# EAGLE design Nova_Placa (EAGLE 9.7.0)
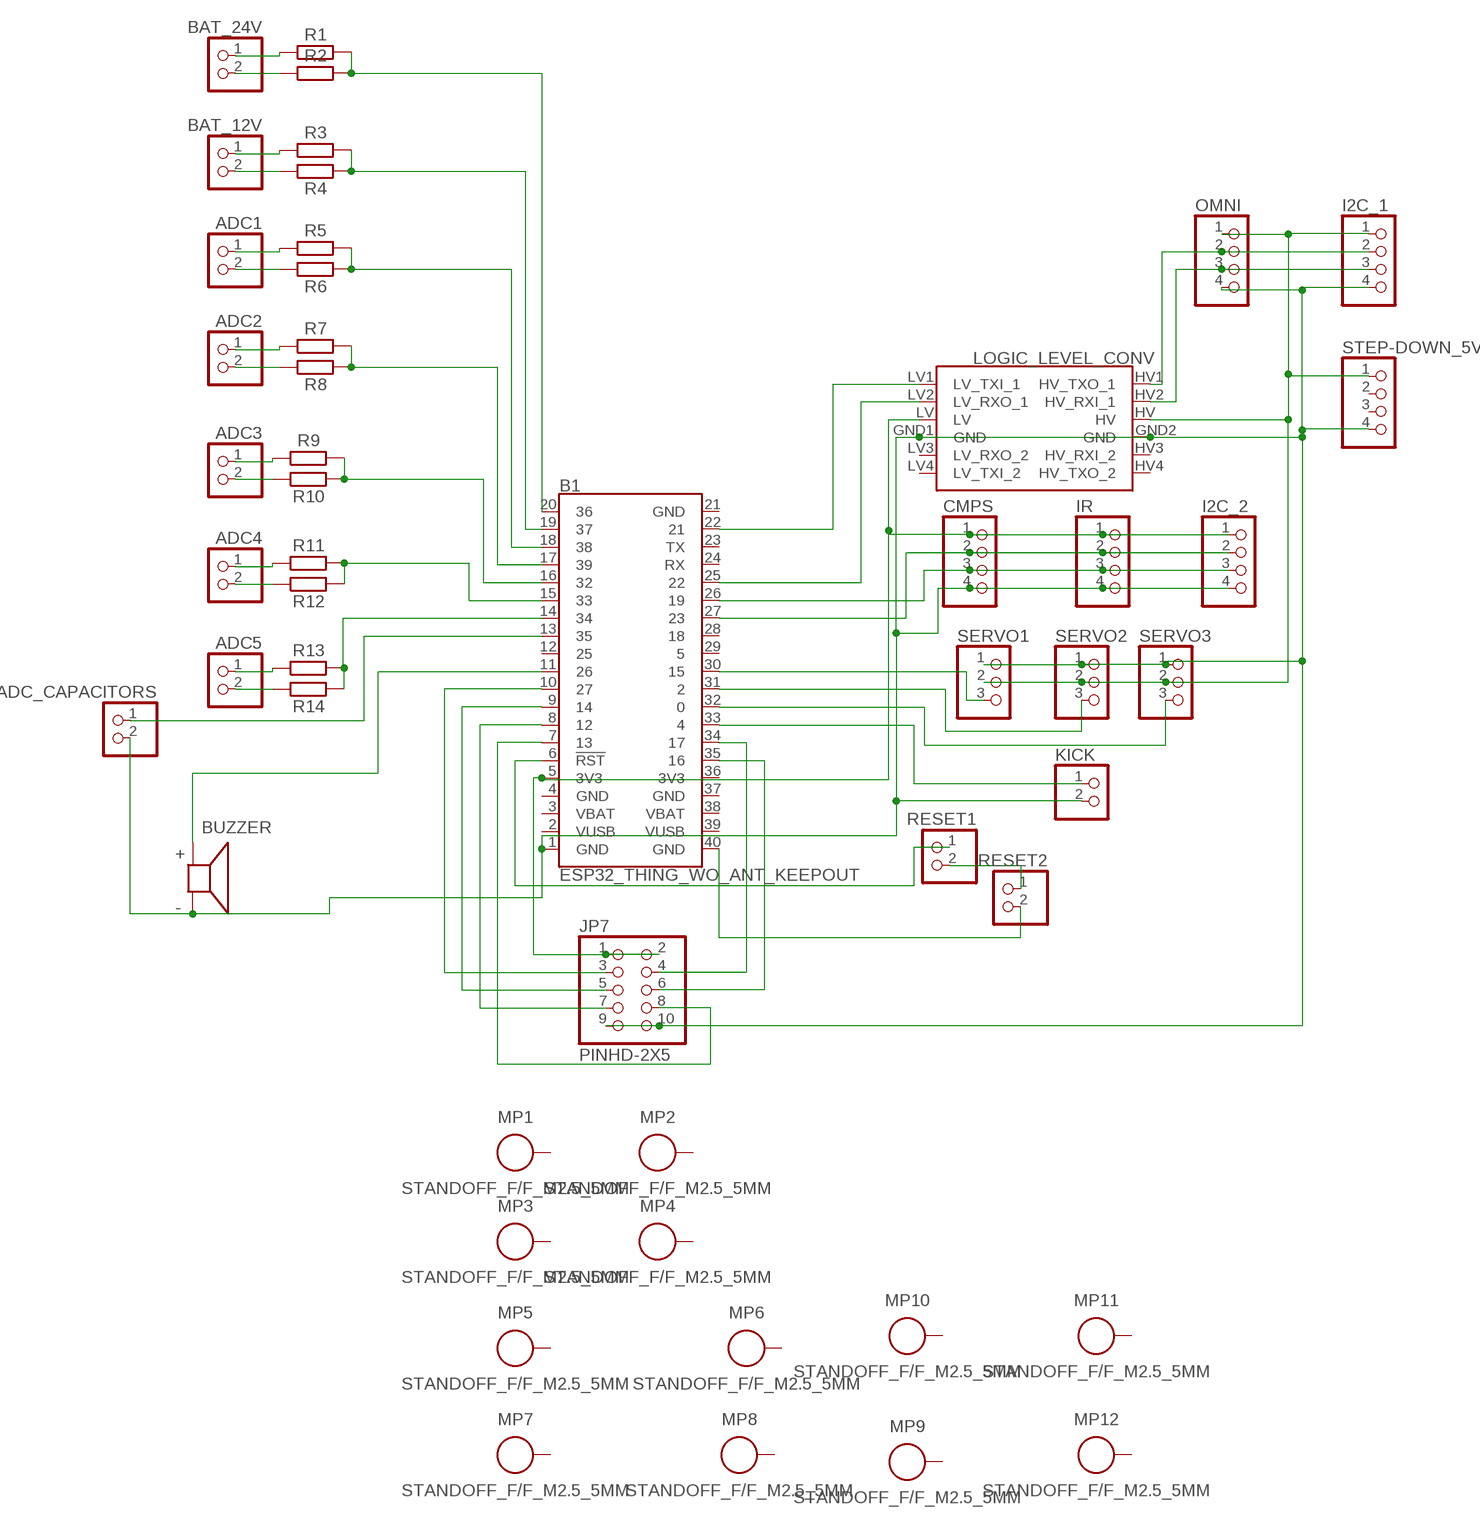
[diagram p0: schematic, sheet 1]

## Parts
ADC1  PINHD-1X2  [1X02]
ADC2  PINHD-1X2  [1X02]
ADC3  PINHD-1X2  [1X02]
ADC4  PINHD-1X2  [1X02]
ADC5  PINHD-1X2  [1X02]
ADC_CAPACITORS  PINHD-1X2  [1X02]
B1  ESP32_THING_WO_ANT_KEEPOUT  [ESP32_THING_NO_ANT]
BAT_12V  PINHD-1X2  [1X02]
BAT_24V  PINHD-1X2  [1X02]
BUZZER  AT-1220-TT-9-R  [XDCR_AT-1220-TT-9-R]
CMPS  PINHD-1X4  [1X04]
I2C_1  PINHD-1X4  [1X04]
I2C_2  PINHD-1X4  [1X04]
IR  PINHD-1X4  [1X04]
JP7  PINHD-2X5  [2X05]
KICK  PINHD-1X2  [1X02]
LOGIC_LEVEL_CONV  SPARKFUN_LOGIC_LEVEL_CONVERTERLOCK  [SPARKFUN_LOGIC_LEVEL_CONVERTER_LOCK]
MP1  STANDOFF_F/F_M2.5_5MM  [STANDOFF_HEX_FEMALE_500X500_M2.5X0.45_MTGP755H270]
MP2  STANDOFF_F/F_M2.5_5MM  [STANDOFF_HEX_FEMALE_500X500_M2.5X0.45_MTGP755H270]
MP3  STANDOFF_F/F_M2.5_5MM  [STANDOFF_HEX_FEMALE_500X500_M2.5X0.45_MTGP755H270]
MP4  STANDOFF_F/F_M2.5_5MM  [STANDOFF_HEX_FEMALE_500X500_M2.5X0.45_MTGP755H270]
MP5  STANDOFF_F/F_M2.5_5MM  [STANDOFF_HEX_FEMALE_500X500_M2.5X0.45_MTGP755H270]
MP6  STANDOFF_F/F_M2.5_5MM  [STANDOFF_HEX_FEMALE_500X500_M2.5X0.45_MTGP755H270]
MP7  STANDOFF_F/F_M2.5_5MM  [STANDOFF_HEX_FEMALE_500X500_M2.5X0.45_MTGP755H270]
MP8  STANDOFF_F/F_M2.5_5MM  [STANDOFF_HEX_FEMALE_500X500_M2.5X0.45_MTGP755H270]
MP9  STANDOFF_F/F_M2.5_5MM  [STANDOFF_HEX_FEMALE_500X500_M2.5X0.45_MTGP755H270]
MP10  STANDOFF_F/F_M2.5_5MM  [STANDOFF_HEX_FEMALE_500X500_M2.5X0.45_MTGP755H270]
MP11  STANDOFF_F/F_M2.5_5MM  [STANDOFF_HEX_FEMALE_500X500_M2.5X0.45_MTGP755H270]
MP12  STANDOFF_F/F_M2.5_5MM  [STANDOFF_HEX_FEMALE_500X500_M2.5X0.45_MTGP755H270]
OMNI  PINHD-1X4  [1X04]
R1  R_AXIAL-7.2MM-PITCH  [RESAD724W46L381D178B]
R2  R_AXIAL-7.2MM-PITCH  [RESAD724W46L381D178B]
R3  R_AXIAL-7.2MM-PITCH  [RESAD724W46L381D178B]
R4  R_AXIAL-7.2MM-PITCH  [RESAD724W46L381D178B]
R5  R_AXIAL-7.2MM-PITCH  [RESAD724W46L381D178B]
R6  R_AXIAL-7.2MM-PITCH  [RESAD724W46L381D178B]
R7  R_AXIAL-7.2MM-PITCH  [RESAD724W46L381D178B]
R8  R_AXIAL-7.2MM-PITCH  [RESAD724W46L381D178B]
R9  R_AXIAL-7.2MM-PITCH  [RESAD724W46L381D178B]
R10  R_AXIAL-7.2MM-PITCH  [RESAD724W46L381D178B]
R11  R_AXIAL-7.2MM-PITCH  [RESAD724W46L381D178B]
R12  R_AXIAL-7.2MM-PITCH  [RESAD724W46L381D178B]
R13  R_AXIAL-7.2MM-PITCH  [RESAD724W46L381D178B]
R14  R_AXIAL-7.2MM-PITCH  [RESAD724W46L381D178B]
RESET1  PINHD-1X2  [1X02]
RESET2  PINHD-1X2  [1X02]
SERVO1  PINHD-1X3  [1X03]
SERVO2  PINHD-1X3  [1X03]
SERVO3  PINHD-1X3  [1X03]
STEP-DOWN_5V  PINHD-1X4  [1X04]

## Nets
N$1: B1.35 JP7.6
N$2: ADC_CAPACITORS.2 B1.1(GND) BUZZER.N CMPS.4 I2C_1.4 I2C_2.4 IR.4 JP7.9 JP7.10 KICK.2 LOGIC_LEVEL_CONV.GND1(GND) LOGIC_LEVEL_CONV.GND2(GND) OMNI.4 SERVO1.1 SERVO2.1 SERVO3.1 STEP-DOWN_5V.4
N$3: B1.22 LOGIC_LEVEL_CONV.LV1(LV_TXI_1)
N$4: B1.25 LOGIC_LEVEL_CONV.LV2(LV_RXO_1)
N$5: B1.5(3V3) CMPS.1 I2C_2.1 IR.1 JP7.1 JP7.2 LOGIC_LEVEL_CONV.LV
N$6: I2C_1.1 LOGIC_LEVEL_CONV.HV OMNI.1 SERVO1.2 SERVO2.2 SERVO3.2 STEP-DOWN_5V.1
N$7: B1.27 CMPS.2 I2C_2.2 IR.2
N$8: B1.26 CMPS.3 I2C_2.3 IR.3
N$9: I2C_1.2 LOGIC_LEVEL_CONV.HV1(HV_TXO_1) OMNI.2
N$10: I2C_1.3 LOGIC_LEVEL_CONV.HV2(HV_RXI_1) OMNI.3
N$11: RESET1.2 RESET2.1
N$12: B1.34 JP7.4
N$13: B1.7 JP7.8
N$14: B1.8 JP7.7
N$15: B1.9 JP7.5
N$16: B1.10 JP7.3
N$17: ADC5.1 R13.1
N$18: ADC5.2 R14.1
N$19: B1.14 R13.2 R14.2
N$20: ADC4.2 R12.1
N$21: B1.15 R11.2 R12.2
N$22: ADC4.1 R11.1
N$23: ADC3.2 R10.1
N$24: ADC3.1 R9.1
N$25: B1.16 R9.2 R10.2
N$26: ADC2.2 R8.1
N$27: ADC2.1 R7.1
N$28: B1.33 KICK.1
N$29: ADC1.2 R6.1
N$30: ADC1.1 R5.1
N$31: B1.18 R5.2 R6.2
N$32: BAT_12V.2 R4.1
N$33: BAT_12V.1 R3.1
N$34: B1.19 R3.2 R4.2
N$35: BAT_24V.2 R2.1
N$36: BAT_24V.1 R1.1
N$37: B1.20 R1.2 R2.2
N$38: B1.17 R7.2 R8.2
N$39: B1.32 SERVO3.3
N$40: B1.31 SERVO2.3
N$41: B1.30 SERVO1.3
N$42: B1.40(GND) RESET2.2
N$43: B1.11 BUZZER.P
N$44: ADC_CAPACITORS.1 B1.13
N$45: B1.6(!RST!) RESET1.1
Unconnected: B1.2(VUSB) B1.3(VBAT) B1.4(GND) B1.12 B1.21(GND) B1.23(TX) B1.24(RX) B1.28 B1.29 B1.36(3V3) B1.37(GND) B1.38(VBAT) B1.39(VUSB) LOGIC_LEVEL_CONV.HV3(HV_RXI_2) LOGIC_LEVEL_CONV.HV4(HV_TXO_2) LOGIC_LEVEL_CONV.LV3(LV_RXO_2) LOGIC_LEVEL_CONV.LV4(LV_TXI_2) MP1.1 MP2.1 MP3.1 MP4.1 MP5.1 MP6.1 MP7.1 MP8.1 MP9.1 MP10.1 MP11.1 MP12.1 STEP-DOWN_5V.2 STEP-DOWN_5V.3

## Library data of the parts
ADC1-ADC5 ADC_CAPACITORS BAT_12V BAT_24V KICK RESET1 RESET2 = Connector:PINHD-1X2: PIN HEADER; CATEGORY: CONNECTOR; SUB-CATEGORY: PIN-HEADER
B1 = SparkFun-Boards:ESP32_THING: SparkFun ESP32 Thing Board Pins, silkscreen, and logos matching the layout of the SparkFun ESP32 Thing <https://www.sparkfun.com/products/13907> Dimensions: 2.32" x 1.00"
BUZZER = Buzzer:AT-1220-TT-9-R: AUDIO TRANSDUCER 3.5 VP-P 85 DB 2048 HZ; MANUFACTURER: PUI Audio; MAXIMUM_PACKAGE_HEIGHT: 8.7 mm; PARTREV: A; STANDARD: Manufacturer Recommendations
CMPS I2C_1 I2C_2 IR OMNI STEP-DOWN_5V = Connector:PINHD-1X4: PIN HEADER; CATEGORY: CONNECTOR; SUB-CATEGORY: PIN-HEADER
JP7 = Connector:PINHD-2X5: PIN HEADER; CATEGORY: CONNECTOR; SUB-CATEGORY: PIN-HEADER
LOGIC_LEVEL_CONV = SparkFun-Boards:SPARKFUN_LOGIC_LEVEL_CONVERTER: SparkFun Logic Level Converter -Bi-Directional This is the mechnical outline for the 3.3V - 5V bi directional logic level converter. *Note, the "LOCK" Package has the header pins staggered by an offset of 5 mils (off center line), so that when you slide a row of standard 0.1" headers into the PTH pads, it will hold position vertically. See the follwing turorial for more information on this type of special footprints: Sneaky Footprints <https://www.sparkfun.com/tutorials/114> SparkFun Products: SparkFun Logic Level Converter - Bi-Directional <https://www.sparkfun.com/products/12009>
MP1-MP12 = PCB-Fasteners_Hardware:STANDOFF_F/F: Female-Female Standoff/Spacer with Mounting pad and hole. Essentra : Female Standoff <https://www.essentracomponents.co.in/index.php?option=com_virtuemart&view=productdetails&virtuemart_product_id=14493> The hole and pad sizes may vary based on the application and type of hardware; always verify the Manufacturer specification or Global Standards.; CATEGORY: Standoff/Spacer; SUB-CATEGORY: Female-Female
R1-R14 = Resistor:R: Resistor Fixed - Generic; CATEGORY: Resistor; SUB-CATEGORY: Fixed
SERVO1-SERVO3 = Connector:PINHD-1X3: PIN HEADER; CATEGORY: CONNECTOR; SUB-CATEGORY: PIN-HEADER

## Board
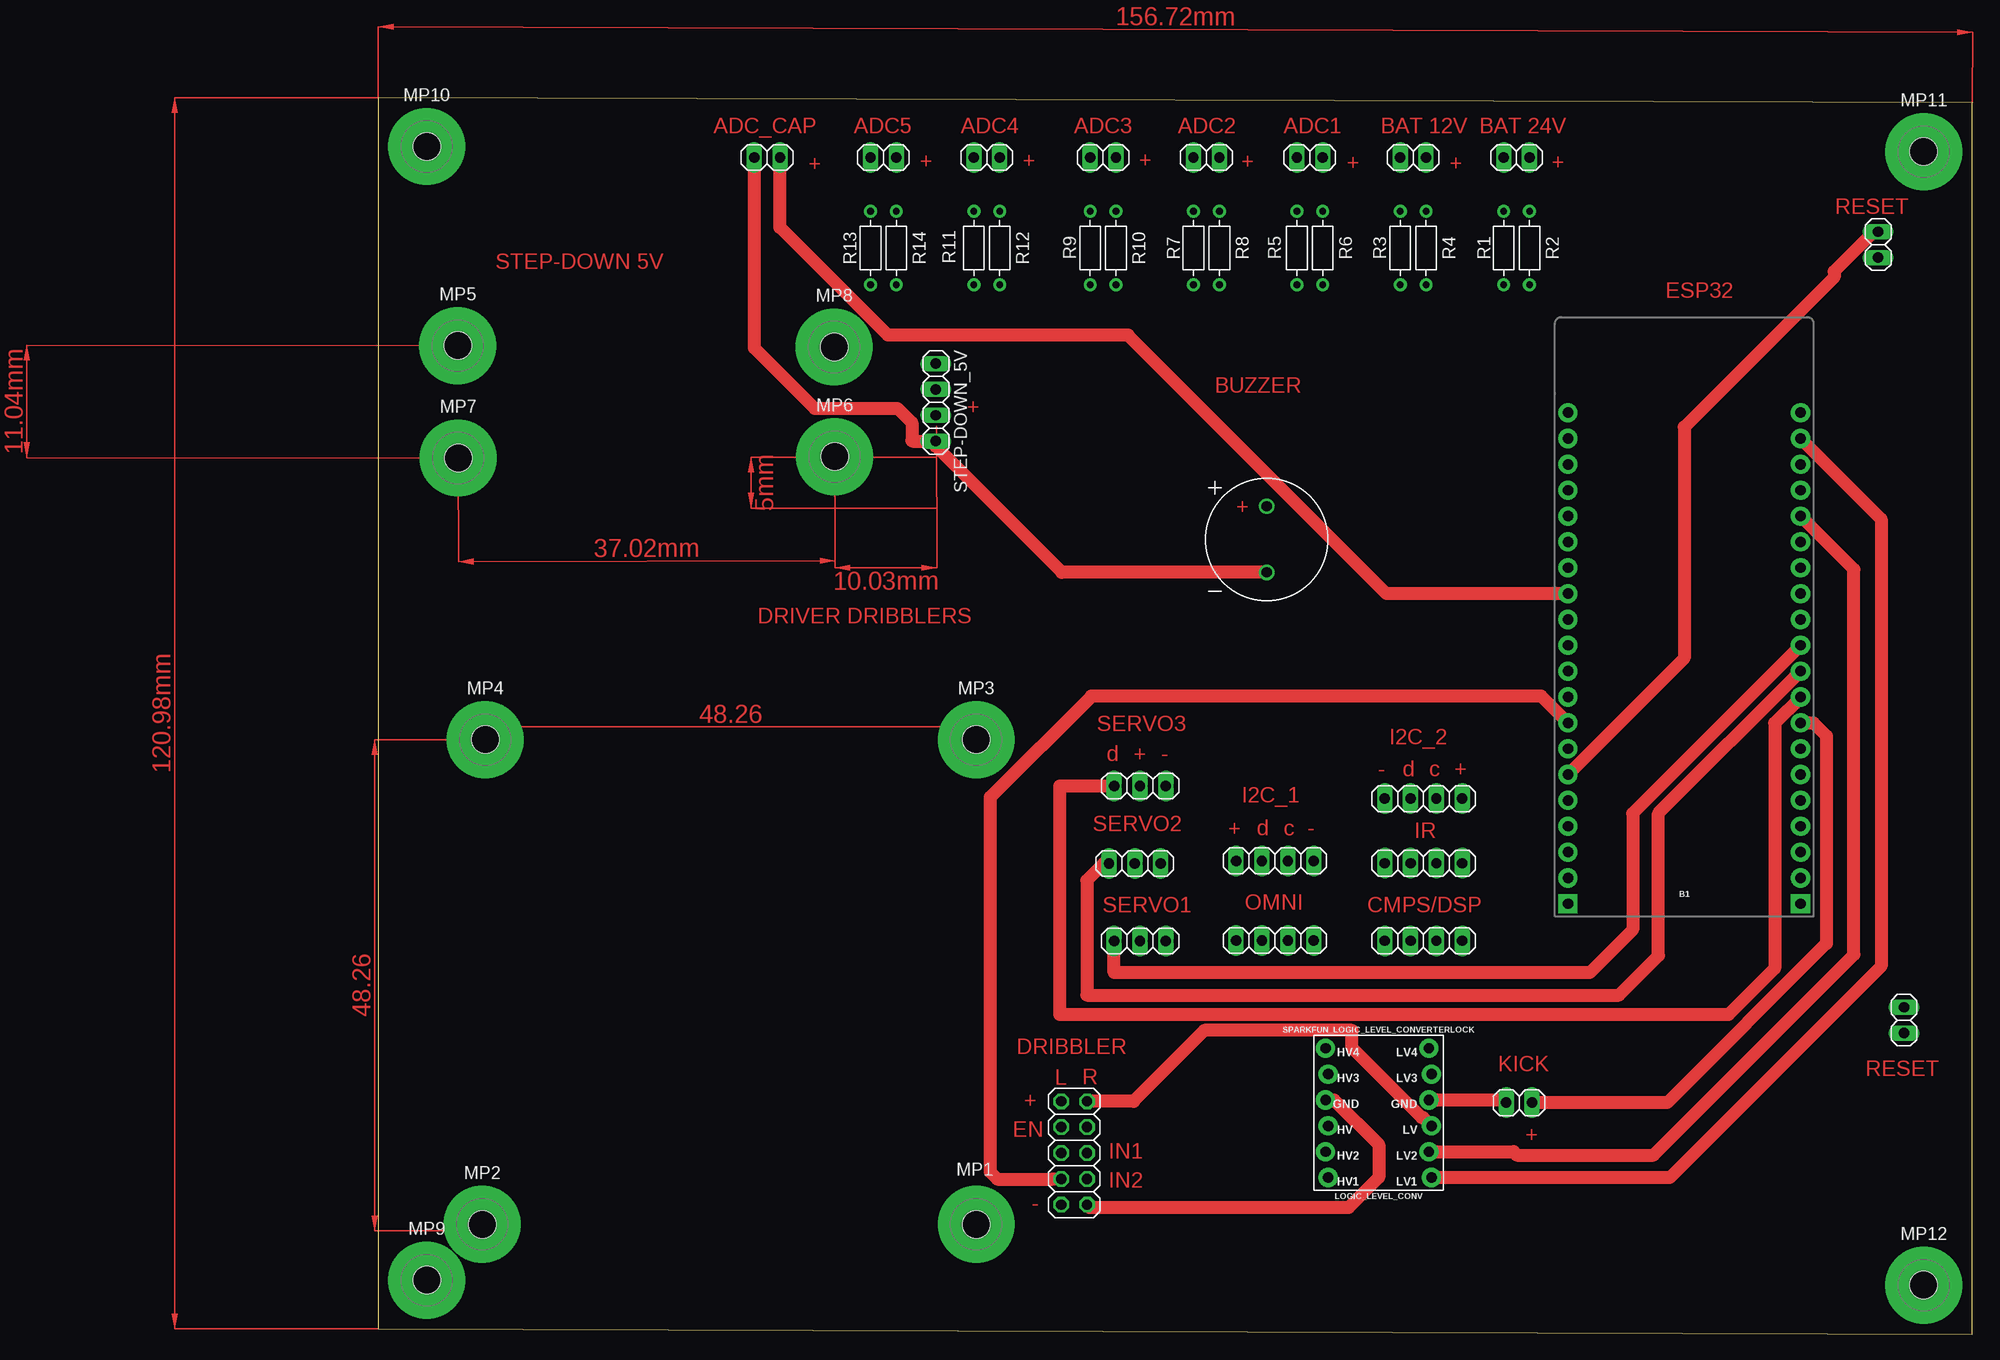
[diagram p1: board, top side]
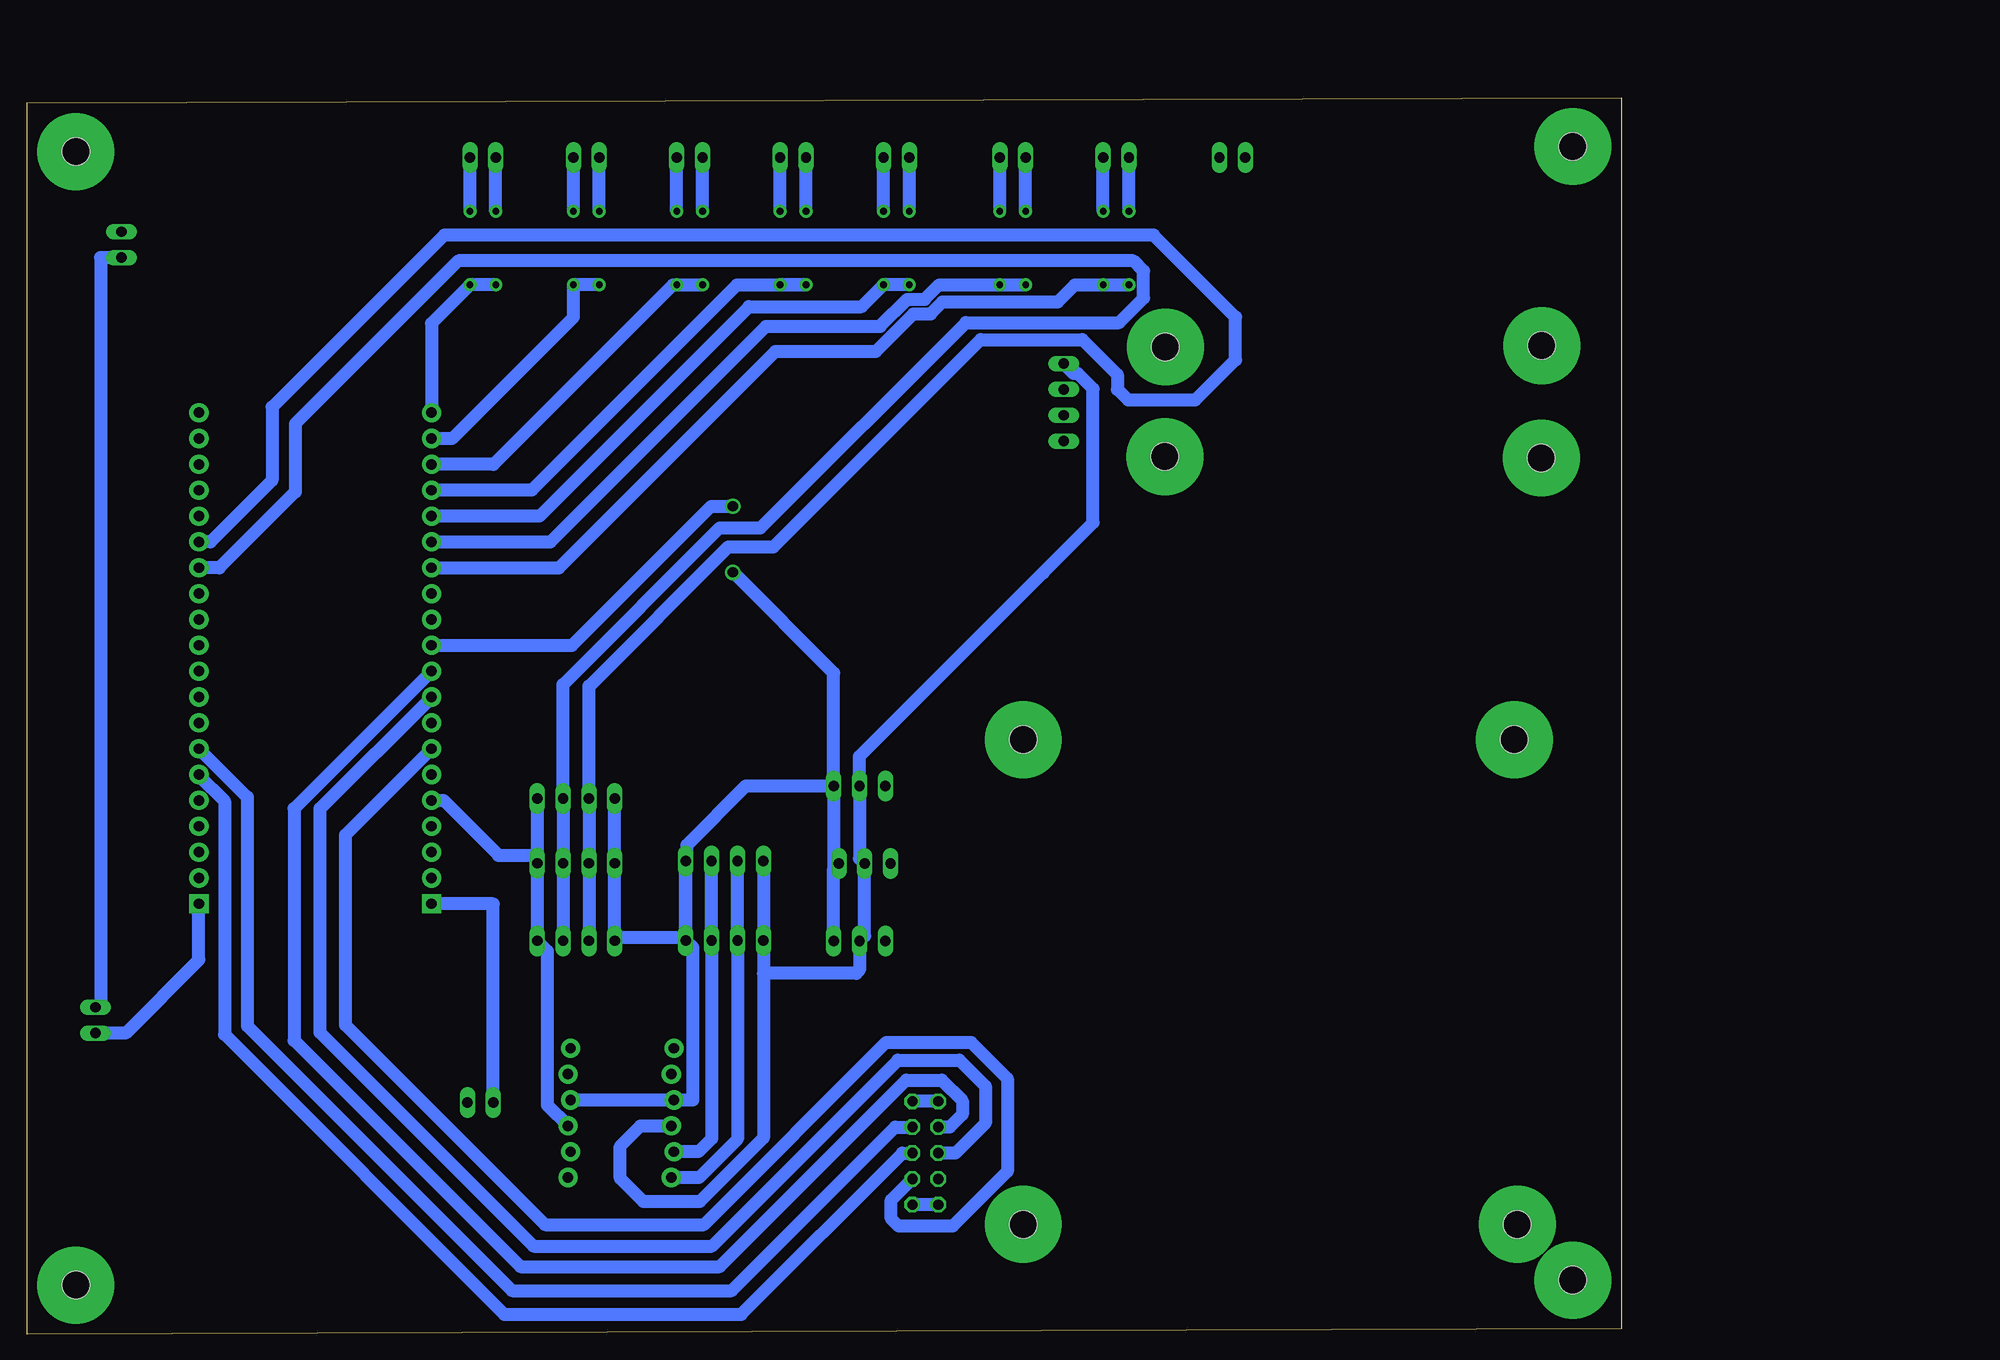
[diagram p2: board, bottom side, seen from below]

Size 156.72 x 121.51 mm. Coordinates in mm from the lower left corner, seen from the top.
Outline: 0,0.53 156.72,0 156.72,120.98 0,121.51 0,0.53
Copper layers (1*16): Top 0.035mm / dielectric 1.5mm / Bottom 0.035mm
Design rules "Fusion Electronics Design Rules": minimum track width 6mil, minimum drill 0.35mm, track to track 6mil, track to pad 6mil, pad to pad 6mil, via to via 6mil, smd to smd 6mil, copper to edge 40mil, drill to drill 6mil, minimum pad ring 10mil, minimum via ring 8mil, stop-mask expansion 4mil, vias tented up to drill 0mil, thermal gap 10mil

### Footprints (pad centres in the part's own frame; a part is rotated, then mirrored left to right if it is on the bottom)
1X02 = drill 1.016 long: 1 -1.27,0; 2 1.27,0
ESP32_THING_NO_ANT = drill 1.016 pad 1.88 square: 1 1.27,1.27; 40 24.13,1.27 | drill 1.016 pad 1.88: 2 1.27,3.81; 3 1.27,6.35; 4 1.27,8.89; 5 1.27,11.43; 6 1.27,13.97; 7 1.27,16.51; 8 1.27,19.05; 9 1.27,21.59; 10 1.27,24.13; 11 1.27,26.67; 12 1.27,29.21; 13 1.27,31.75; 14 1.27,34.29; 15 1.27,36.83; 16 1.27,39.37; 17 1.27,41.91; 18 1.27,44.45; 19 1.27,46.99; 20 1.27,49.53; 21 24.13,49.53; 22 24.13,46.99; 23 24.13,44.45; 24 24.13,41.91; 25 24.13,39.37; 26 24.13,36.83; 27 24.13,34.29; 28 24.13,31.75; 29 24.13,29.21; 30 24.13,26.67; 31 24.13,24.13; 32 24.13,21.59; 33 24.13,19.05; 34 24.13,16.51; 35 24.13,13.97; 36 24.13,11.43; 37 24.13,8.89; 38 24.13,6.35; 39 24.13,3.81
XDCR_AT-1220-TT-9-R = drill 1: N 0,-3.25; P 0,3.25
1X04 = drill 1.016 long: 1 -3.81,0; 2 -1.27,0; 3 1.27,0; 4 3.81,0
2X05 = drill 1.016 octagon: 1 -5.08,-1.27; 2 -5.08,1.27; 3 -2.54,-1.27; 4 -2.54,1.27; 5 0,-1.27; 6 0,1.27; 7 2.54,-1.27; 8 2.54,1.27; 9 5.08,-1.27; 10 5.08,1.27
SPARKFUN_LOGIC_LEVEL_CONVERTER_LOCK = drill 1.016 pad 1.88: GND1 -4.953,-1.27; GND2 5.207,-1.27; HV 4.953,1.27; HV1 4.953,6.35; HV2 5.207,3.81; HV3 4.953,-3.81; HV4 5.207,-6.35; LV -5.207,1.27; LV1 -5.207,6.35; LV2 -4.953,3.81; LV3 -5.207,-3.81; LV4 -4.953,-6.35
STANDOFF_HEX_FEMALE_500X500_M2.5X0.45_MTGP755H270 = drill 2.7 pad 7.55: 1 0,0 | hole 2.7: 0,0
RESAD724W46L381D178B = drill 0.66 pad 1.26: 1 -3.62,0; 2 3.62,0
1X03 = drill 1.016 long: 1 -2.54,0; 2 0,0; 3 2.54,0

### Placement (x,y rotation side)
ADC1  91.59,115.62 0 top
ADC2  81.43,115.62 0 top
ADC3  71.27,115.62 0 top
ADC4  59.84,115.62 0 top
ADC5  49.68,115.62 0 top
ADC_CAPACITORS  38.25,115.62 180 top
B1  115.7,41.02 0 top
BAT_12V  101.75,115.62 0 top
BAT_24V  111.91,115.62 0 top
BUZZER  87.35,78.11 0 top
CMPS  102.77,46.28 180 top
I2C_1  88.16,46.51 0 top
I2C_2  102.77,38.66 180 top
IR  102.77,52.63 180 top
JP7  68.43,17.81 270 top
KICK  112.17,22.76 180 top
LOGIC_LEVEL_CONV  98.35,21.74 180 top
MP1  58.8,10.79 0 top
MP2  10.25,10.79 0 top
MP3  58.8,58.42 0 top
MP4  10.54,58.42 0 top
MP5  7.84,97.13 0 top
MP6  44.88,86.22 0 top
MP7  7.89,86.09 0 top
MP8  44.83,97 0 top
MP9  4.79,5.31 0 top
MP10  4.79,116.7 0 top
MP11  151.93,116.2 0 top
MP12  151.93,4.81 0 top
OMNI  88.16,38.68 0 top
R1  110.64,106.73 270 top
R2  113.18,106.73 270 top
R3  100.48,106.73 270 top
R4  103.02,106.73 270 top
R5  90.32,106.73 270 top
R6  92.86,106.73 270 top
R7  80.16,106.73 270 top
R8  82.7,106.73 270 top
R9  70,106.73 270 top
R10  72.54,106.73 270 top
R11  58.57,106.73 270 top
R12  61.11,106.73 270 top
R13  48.41,106.73 270 top
R14  50.95,106.73 270 top
RESET1  147.45,107.06 270 top
RESET2  149.99,30.86 270 top
SERVO1  74.9,38.63 180 top
SERVO2  74.4,46.25 180 top
SERVO3  74.9,53.87 180 top
STEP-DOWN_5V  54.84,91.57 270 top

### Tracks (layer width: path | path; a pad name or v marks a point on that pad's centre or on a via)
N$1
  Bottom 1.27: B1.35 139.83,54.89 137.31,52.38 137.31,29.45 109.82,1.96 86.54,1.96 70.69,17.8 JP7.6
N$2
  Top 1.27: KICK.2 110.64,23.01 LOGIC_LEVEL_CONV.GND1 | LOGIC_LEVEL_CONV.GND2 93.98,23.01 98.37,18.62 98.37,15.42 95.43,12.47 69.95,12.47 JP7.10 | BUZZER.N 67.22,74.86 54.84,87.24 STEP-DOWN_5V.4 52.53,87.76 52.48,87.81 52.48,89.56 51.05,90.98 42.93,90.98 36.98,96.93 ADC_CAPACITORS.2
  Bottom 1.27: I2C_1.4 OMNI.4 91.29,38 91.29,23.01 LOGIC_LEVEL_CONV.GND2 LOGIC_LEVEL_CONV.GND1 | I2C_2.4 CMPS.4 IR.4 | I2C_1.4 91.97,39.01 98.6,39.01 I2C_2.4 | I2C_2.4 98.96,37.9 | KICK.2 110.9,42.29 B1.1 | I2C_1.4 91.87,46.61 91.87,48.09 86.09,53.87 SERVO3.1 | SERVO1.1 77.45,45.75 | 77.45,45.75 SERVO2.1 | SERVO3.1 77.45,45.75 | SERVO3.1 77.45,64.95 BUZZER.N | JP7.9 JP7.10
N$3
  Top 1.27: LOGIC_LEVEL_CONV.LV1 126.98,15.39 147.75,36.17 147.75,80.09 B1.22
N$4
  Top 1.27: B1.25 145.06,75.16 145.06,37.29 125.36,17.59 111.94,17.59 111.6,17.93 LOGIC_LEVEL_CONV.LV2
N$5
  Top 1.27: LOGIC_LEVEL_CONV.LV 102.74,21.29 102.59,21.29 95.73,28.14 95.73,29.84 81.23,29.84 74.27,22.89 JP7.2
  Bottom 1.27: IR.1 106.58,47.04 | B1.5 115.8,52.45 110.39,47.04 106.58,47.04 | 106.58,47.04 CMPS.1 I2C_2.1 105.59,37.67 105.59,22.5 LOGIC_LEVEL_CONV.LV | JP7.1 JP7.2
N$6
  Bottom 1.27: I2C_1.1 OMNI.1 84.35,35.46 | LOGIC_LEVEL_CONV.HV 96.42,20.47 98.42,18.47 98.42,15.32 96.14,13.03 90.62,13.03 84.35,19.29 84.35,35.46 | 84.35,35.46 75.21,35.46 74.91,35.76 SERVO1.2 74.4,39.14 SERVO2.2 74.91,46.76 SERVO3.2 74.91,56.78 56.86,74.82 51.94,79.74 51.94,92.9 53.44,94.39 53.85,94.39 STEP-DOWN_5V.1
N$7
  Bottom 1.27: B1.27 137.81,75.31 130.35,82.77 130.35,89.45 114.34,105.46 47.99,105.46 46.99,104.46 46.99,101.81 49.4,99.4 64.46,99.4 84.63,79.23 88.64,79.23 104.04,63.83 IR.2 CMPS.2 I2C_2.2
N$8
  Bottom 1.27: I2C_2.3 CMPS.3 IR.3 101.5,63.67 87.81,77.36 83.37,77.36 63,97.73 53,97.73 49.55,94.28 49.55,92.84 48.51,91.8 41.88,91.8 37.95,95.73 37.95,99.95 46,108 115.72,108 132.64,91.08 132.64,83.91 138.69,77.85 B1.26
N$9
  Bottom 1.27: OMNI.2 86.89,37.66 | OMNI.2 I2C_1.2 | OMNI.2 86.89,19.17 90.67,15.39 LOGIC_LEVEL_CONV.HV1
N$10
  Bottom 1.27: OMNI.3 89.43,38.27 | OMNI.3 I2C_1.3 | OMNI.3 89.43,19.23 90.73,17.93 LOGIC_LEVEL_CONV.HV2
N$11
  Bottom 1.27: RESET1.2 149.48,105.79 149.48,32.13 RESET2.1
N$12
  Bottom 1.27: B1.34 135.08,52.78 135.08,30.3 109.07,4.29 87.45,4.29 71.4,20.34 JP7.4
N$13
  Bottom 1.27: B1.7 125.45,49.05 125.45,30.4 105.82,10.77 90.18,10.77 72.27,28.68 63.94,28.68 60.38,25.11 60.38,16 65.75,10.62 71.05,10.62 71.78,11.35 71.78,13.18 JP7.8
N$14
  Top 1.27: B1.8 114.34,62.7 70.11,62.7 60.17,52.76 60.17,15.96 60.89,15.25 66.28,15.25 66.3,15.27 JP7.7
N$15
  Bottom 1.27: B1.9 127.94,51.64 127.94,29.67 106.93,8.66 89.4,8.66 71.14,26.92 65.09,26.92 62.53,24.37 62.53,20.75 65.48,17.8 JP7.5
N$16
  Bottom 1.27: B1.10 130.48,51.64 130.48,28.88 108.23,6.63 88.64,6.63 70.31,24.97 66.83,24.97 64.8,22.94 64.8,21.59 66.04,20.34 JP7.3
N$17
  Bottom 1.27: R13.1 ADC5.1
N$18
  Bottom 1.27: R14.1 ADC5.2
N$19
  Bottom 1.27: R13.2 R14.2 53.74,103.11 55.42,101.43 66.74,101.43 67.91,100.27 69.62,100.27 73.3,96.58 83.16,96.58 104.43,75.31 B1.14
N$20
  Bottom 1.27: R12.1 ADC4.2
N$21
  Bottom 1.27: R11.2 R12.2 67.08,103.11 68.5,101.69 70.21,101.69 72.87,99.02 84.09,99.02 105.27,77.85 B1.15
N$22
  Bottom 1.27: R11.1 ADC4.1
N$23
  Bottom 1.27: R10.1 ADC3.2
N$24
  Bottom 1.27: R9.1 ADC3.1
N$25
  Bottom 1.27: R9.2 R10.2 74.69,100.97 85.78,100.97 106.35,80.39 B1.16
N$26
  Bottom 1.27: R8.1 ADC2.2
N$27
  Bottom 1.27: R7.1 ADC2.1
N$28
  Top 1.27: KICK.1 126.72,22.76 142.37,38.41 142.37,58.8 141.1,60.07 B1.33
N$29
  Bottom 1.27: R6.1 ADC1.2
N$30
  Bottom 1.27: R5.1 ADC1.1
N$31
  Bottom 1.27: R6.2 R5.2 93.23,103.11 110.87,85.47 B1.18
N$32
  Bottom 1.27: R4.1 BAT_12V.2
N$33
  Bottom 1.27: R3.1 BAT_12V.1
N$34
  Bottom 1.27: B1.19 114.96,88.01 103.02,99.95 R4.2 R3.2
N$35
  Bottom 1.27: R2.1 BAT_24V.2
N$36
  Bottom 1.27: R1.1 BAT_24V.1
N$37
  Bottom 1.27: B1.20 116.97,99.33 R2.2 R1.2
N$38
  Bottom 1.27: B1.17 107.12,82.93 86.94,103.11 R7.2 R8.2
N$39
  Top 1.27: B1.32 137.29,60.07 137.29,35.94 132.74,31.39 67.02,31.39 67.02,53.87 SERVO3.3
N$40
  Top 1.27: B1.31 125.86,51.18 125.86,37.21 121.97,33.33 69.67,33.33 69.67,44.58 71.34,46.25 SERVO2.3
N$41
  Top 1.27: B1.30 123.32,51.18 123.32,39.75 119.1,35.53 72.36,35.53 SERVO1.3
N$42
  Bottom 1.27: B1.40 139.83,36.8 147.03,29.59 RESET2.2
N$43
  Bottom 1.27: B1.11 103.15,67.69 89.48,81.36 BUZZER.P
N$44
  Top 1.27: B1.13 99.14,72.77 73.74,98.17 50.12,98.17 39.52,108.76 ADC_CAPACITORS.1
N$45
  Top 1.27: B1.6 128.4,66.42 128.4,89.13 143.13,103.87 143.13,104.43 147.03,108.33 RESET1.1
(copper drawn outside any net)
  shapes: Top area x8

### Text on the board
Top: ADC_CAP | ADC5 | ADC4 | ADC3 | ADC2 | ADC1 | BAT 12V | BAT 24V | + | + | + | + | + | + | + | + | RESET | STEP-DOWN 5V | ESP32 | BUZZER | + | + | DRIVER DRIBBLERS | SERVO3 | I2C_2 | d | + | - | - | d | c | + | I2C_1 | SERVO2 | + | d | c | - | IR | SERVO1 | OMNI | CMPS/DSP | DRIBBLER | KICK | RESET | L | R | + | EN | + | IN1 | IN2 | -